# Altium schematic sheet Volume_Tone_Control.SchDoc
size Letter; SheetNumber: 2; SheetTotal: 3
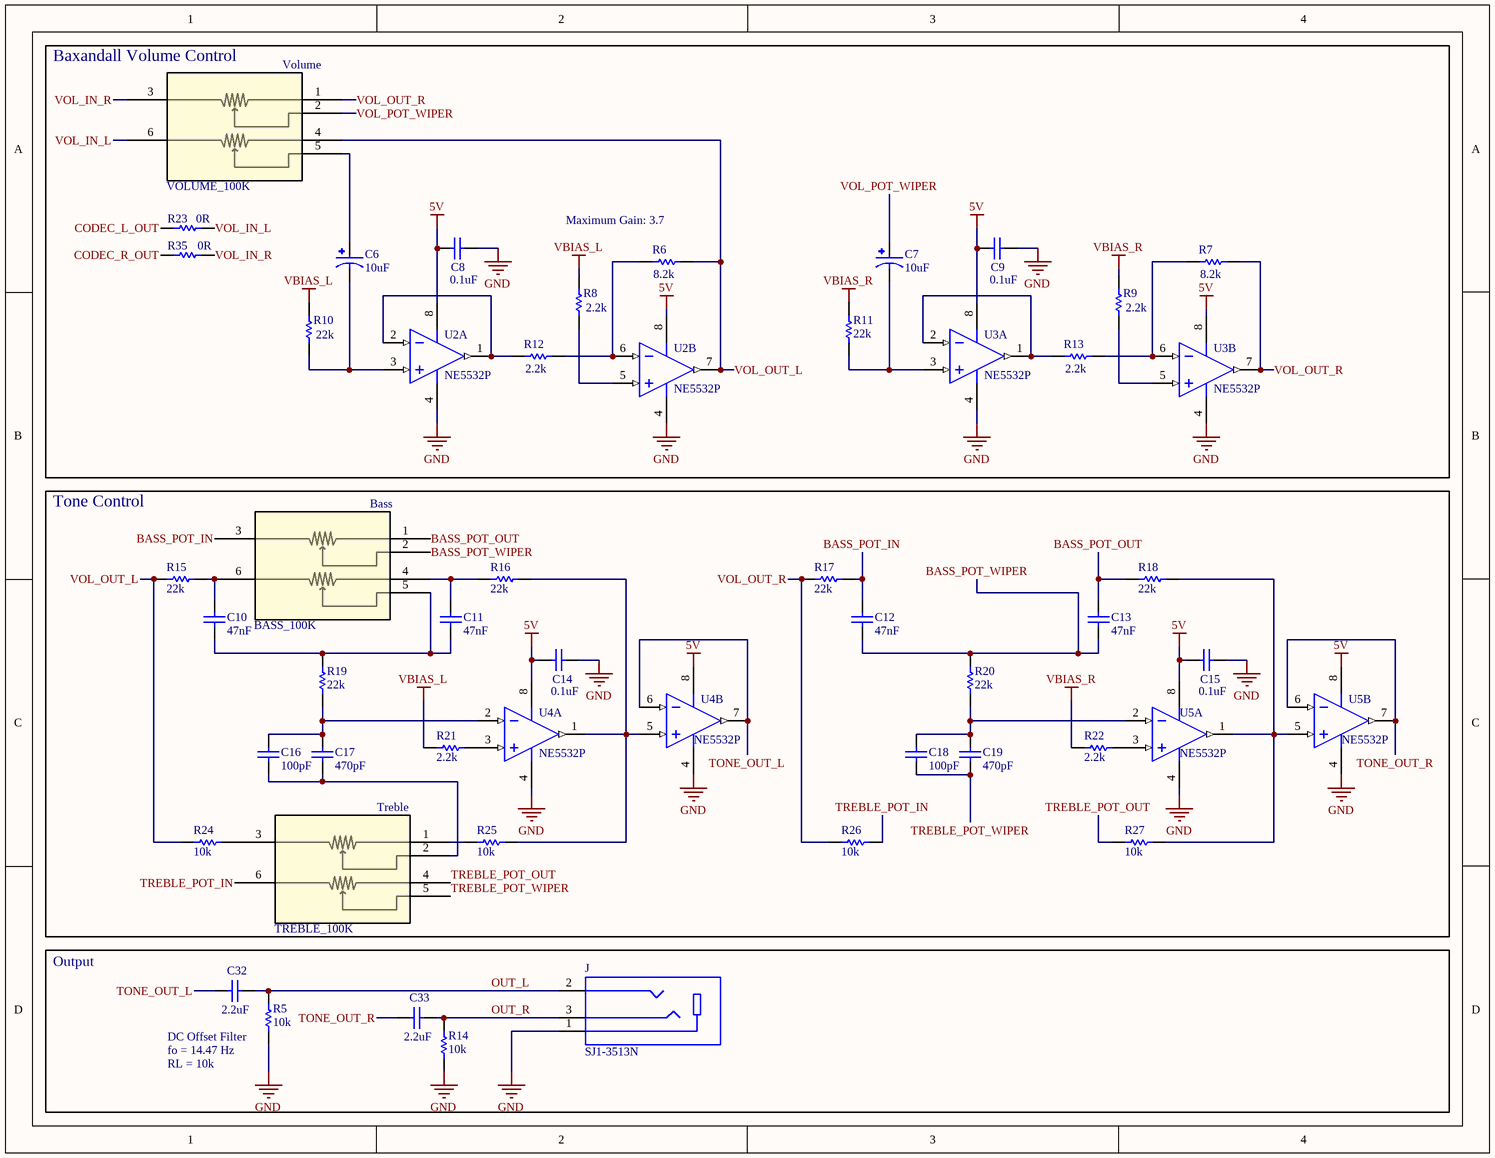
[diagram p0: Volume_Tone_Control.SchDoc]

## Parts
Bass  BASS_100K  [Bourns_PDB182-K425K-103A_0]
C6  10uF  [CAPPRD200W50D500H1500]
C7  10uF  [CAPPRD200W50D500H1500]
C8  value 0.1uF  [RAD-0.1]  (hidden comment: Cap)
C9  value 0.1uF  [RAD-0.1]  (hidden comment: Cap)
C10  value 47nF  [RAD-0.1]  (hidden comment: Cap)
C11  value 47nF  [RAD-0.1]  (hidden comment: Cap)
C12  value 47nF  [RAD-0.1]  (hidden comment: Cap)
C13  value 47nF  [RAD-0.1]  (hidden comment: Cap)
C14  value 0.1uF  [RAD-0.1]  (hidden comment: Cap)
C15  value 0.1uF  [RAD-0.1]  (hidden comment: Cap)
C16  value 100pF  [RAD-0.1]  (hidden comment: Cap)
C17  value 470pF  [RAD-0.1]  (hidden comment: Cap)
C18  value 100pF  [RAD-0.1]  (hidden comment: Cap)
C19  value 470pF  [RAD-0.1]  (hidden comment: Cap)
C32  value 2.2uF  [RAD-0.1]  (hidden comment: Cap)
C33  value 2.2uF  [RAD-0.1]  (hidden comment: Cap)
J  SJ1-3513N  [CUI_SJ1-3513N]
R5  value 10k  [AXIAL-0.3]  (hidden comment: Res1)
R6  value 8.2k  [AXIAL-0.3]  (hidden comment: Res1)
R7  value 8.2k  [AXIAL-0.3]  (hidden comment: Res1)
R8  value 2.2k  [AXIAL-0.3]  (hidden comment: Res1)
R9  value 2.2k  [AXIAL-0.3]  (hidden comment: Res1)
R10  value 22k  [AXIAL-0.3]  (hidden comment: Res1)
R11  value 22k  [AXIAL-0.3]  (hidden comment: Res1)
R12  value 2.2k  [AXIAL-0.3]  (hidden comment: Res1)
R13  value 2.2k  [AXIAL-0.3]  (hidden comment: Res1)
R14  value 10k  [AXIAL-0.3]  (hidden comment: Res1)
R15  value 22k  [AXIAL-0.3]  (hidden comment: Res1)
R16  value 22k  [AXIAL-0.3]  (hidden comment: Res1)
R17  value 22k  [AXIAL-0.3]  (hidden comment: Res1)
R18  value 22k  [AXIAL-0.3]  (hidden comment: Res1)
R19  value 22k  [AXIAL-0.3]  (hidden comment: Res1)
R20  value 22k  [AXIAL-0.3]  (hidden comment: Res1)
R21  value 2.2k  [AXIAL-0.3]  (hidden comment: Res1)
R22  value 2.2k  [AXIAL-0.3]  (hidden comment: Res1)
R23  value 0R  [AXIAL-0.3]  (hidden comment: Res1)
R24  value 10k  [AXIAL-0.3]  (hidden comment: Res1)
R25  value 10k  [AXIAL-0.3]  (hidden comment: Res1)
R26  value 10k  [AXIAL-0.3]  (hidden comment: Res1)
R27  value 10k  [AXIAL-0.3]  (hidden comment: Res1)
R35  value 0R  [AXIAL-0.3]  (hidden comment: Res1)
Treble  TREBLE_100K  [Bourns_PDB182-K425K-103A_0]
U2  NE5532P  [TI-P8]  (parts A,B of 2)
U3  NE5532P  [TI-P8]  (parts A,B of 2)
U4  NE5532P  [TI-P8]  (parts A,B of 2)
U5  NE5532P  [TI-P8]  (parts A,B of 2)
Volume  VOLUME_100K  [PDB-182-K_20K_BRN]

## Blocks framed on the sheet
Baxandall Volume Control: C6-C9 R6-R13 R23 R35 U2 U3 Volume
Tone Control: Bass C10-C19 R15-R22 R24-R27 Treble U4 U5
Output: C32 C33 J R5 R14

## Nets
5V: C8.1 C9.1 C14.1 C15.1 U2.8(VCC+) U3.8(VCC+) U4.8(VCC+) U5.8(VCC+)
GND: C8.2 C9.2 C14.2 C15.2 J.1 R5.2 R14.2 U2.4(VCC-) U3.4(VCC-) U4.4(VCC-) U5.4(VCC-)
VBIAS_L: R8.1 R10.1 R21.1
VBIAS_R: R9.1 R11.1 R22.1
BASS_POT_IN: Bass.3 C12.1 R17.2
BASS_POT_OUT: Bass.1 C13.1 R18.1
BASS_POT_WIPER: Bass.2 C12.2 C13.2 R20.2
CODEC_L_OUT: R23.1
CODEC_R_OUT: R35.1
OUT_L: C32.1 J.2 R5.1
OUT_R: C33.1 J.3 R14.1
TONE_OUT_L: C32.2 U4.6(IN2-) U4.7(OUT2)
TONE_OUT_R: C33.2 U5.6(IN2-) U5.7(OUT2)
TREBLE_POT_IN: R26.2 Treble.6
TREBLE_POT_OUT: R27.2 Treble.4
TREBLE_POT_WIPER: C18.1 C19.1 Treble.5
VOL_IN_L: R23.2 Volume.6
VOL_IN_R: R35.2 Volume.3
VOL_OUT_L: R6.2 R15.1 R24.1 U2.7(OUT2) Volume.4
VOL_OUT_R: R7.2 R17.1 R26.1 U3.7(OUT2) Volume.1
VOL_POT_WIPER: C7.P Volume.2
NetBass_4: Bass.4 C11.1 R16.1
NetBass_5: Bass.5 C10.2 C11.2 R19.2
NetBass_6: Bass.6 C10.1 R15.2
NetC6_N: C6.N R10.2 U2.3(IN1+)
NetC6_P: C6.P Volume.5
NetC7_N: C7.N R11.2 U3.3(IN1+)
NetC16_1: C16.1 C17.1 Treble.2
NetC16_2: C16.2 C17.2 R19.1 U4.2(IN1-)
NetC18_2: C18.2 C19.2 R20.1 U5.2(IN1-)
NetR6_1: R6.1 R12.2 U2.6(IN2-)
NetR7_1: R7.1 R13.2 U3.6(IN2-)
NetR8_2: R8.2 U2.5(IN2+)
NetR9_2: R9.2 U3.5(IN2+)
NetR12_1: R12.1 U2.1(OUT1) U2.2(IN1-)
NetR13_1: R13.1 U3.1(OUT1) U3.2(IN1-)
NetR16_2: R16.2 R25.1 U4.1(OUT1) U4.5(IN2+)
NetR18_2: R18.2 R27.1 U5.1(OUT1) U5.5(IN2+)
NetR21_2: R21.2 U4.3(IN1+)
NetR22_2: R22.2 U5.3(IN1+)
NetR24_2: R24.2 Treble.3
NetR25_2: R25.2 Treble.1

## Notes on the sheet
- (near R6) Maximum Gain: 3.7
- (near R5) DC Offset Filter
- (near R5) fo = 14.47 Hz
- RL = 10k

## Library data of the parts
Bass Treble Volume = PDB182-K420K-103A2: No Description Available; Mfr_Name: Bourns Electronics; Copyright: Copyright (C) 2022 Ultra Librarian. All rights reserved.; Manufacturer_Part_Number: PDB182-K420K-103A2; RefDes: RefDes; Type: DEV
C6 C7 = EEUFC1J101: Capacitor; Aluminum Electrolytic; Radial Al Electrolytic Cap; 100uF 63V; MF: Panasonic Electronic; MP: EEU-FC1J101; Package: RADIAL-2 Panasonic; Price: None; Check_prices: https://www.snapeda.com/parts/EEU-FC1J101/Panasonic%20Electronic%20Components/view-part/494707/?ref=eda; Value: *; SnapEDA_Link: https://www.snapeda.com/parts/EEU-FC1J101/Panasonic%20Electronic%20Components/view-part/494707/?ref=snap; Availability: In Stock
C8-C19 C32 C33 = Cap: Capacitor; Published: 8-Jun-2000; LatestRevisionDate: 17-Jul-2002; LatestRevisionNote: Re-released for DXP Platform.; PackageReference: RAD-0.3; Publisher: Altium Limited; PackageDescription: Radial Cap, Thru-Hole; 2 Leads; 0.3 in Pin Spacing
J = SJ1-3513N: 3.5 mm, Stereo, Right Angle, Through Hole, Audio Jack Connector; MF: CUI Devices; Package: None; CUI_purchase_URL: https://www.cuidevices.com/product/interconnect/connectors/audio-connectors/jacks/sj1-351xn-series?utm_source=snapeda.com&utm_medium=referral&utm_campaign=snapedaBOM; Value: *; Price: None; MP: SJ1-3513N; Availability: Unavailable; SnapEDA_Link: https://www.snapeda.com/parts/SJ1-3513N/CUI%20Devices/view-part/617507/?ref=snap
R5-R27 R35 = Res1: Resistor; Published: 8-Jun-2000; LatestRevisionDate: 17-Jul-2002; LatestRevisionNote: Re-released for DXP Platform.; PackageReference: AXIAL-0.3; Publisher: Altium Limited; PackageDescription: Axial Device, Thru-Hole; 2 Leads; 0.3 in Pin Spacing
U2-U5 = NE5532P: Dual Low-Noise High-Speed Audio Operational Amplifier, 10 to 30 V, 0 to 70 degC, 8-pin DIP (P8), Pb-Free (RoHS); Manufacturer: Texas Instruments; Slew Rate(Typ)(V/us): 9; CMRR(Min)(dB): 70; Sub Family: General Purpose Amplifier, High Supply Voltage Amplifier (>=30V), Low Noise Amp (<=10nV/rtHz); IIB(Max)(pA): 800000; GBW(Typ)(MHz): 10; Iq per channel(Max)(mA): 4; Number of Channels: 2; Vn at 1kHz(Typ)(nV/rtHz): 5; Total Supply Voltage(Max)(+5V is 5, +/-5V is 10): 30; Eco-Plan: Pb-Free (RoHS); PartNumber: NE5532P; ComponentLink1Description: Manufacturer URL; ComponentLink2Description: Datasheet; DatasheetVersion: SLOS075I; ComponentLink3URL: http://www.ti.com/litv/pdf/mpdi001b; ComponentLink1URL: http://www.ti.com/; Code_JEDEC: MS-001; Total Supply Voltage(Min)(+5V is 5, +/-5V is 10): 10; ComponentLink2URL: http://www.ti.com/lit/ds/symlink/ne5532.pdf; PackageReference: P8; ComponentLink3Description: Package Specification; Vio (25C)(Max)(mV): 4; PackageVersion: 4040082/E, 04/2010; Mounting Technology: Through Hole; PackageDescription: 8-Pin Plastic In-Line, Body 9.59 x 6.35 mm, Pitch 2.54 mm